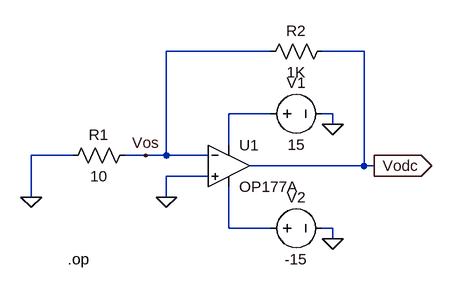
[diagram p0: schematic Run_1.asc]
Run_1.asc, the LTspice schematic file:
Version 4
SHEET 1 880 680
WIRE 352 -32 192 -32
WIRE 496 -32 432 -32
WIRE 352 64 288 64
WIRE 448 64 432 64
WIRE 448 80 448 64
WIRE 288 112 288 64
WIRE 48 128 -16 128
WIRE 160 128 128 128
WIRE 192 128 192 -32
WIRE 192 128 160 128
WIRE 256 128 192 128
WIRE 496 144 496 -32
WIRE 496 144 320 144
WIRE 512 144 496 144
WIRE 256 160 192 160
WIRE -16 192 -16 128
WIRE 192 192 192 160
WIRE 288 240 288 176
WIRE 352 240 288 240
WIRE 448 240 432 240
WIRE 448 256 448 240
FLAG 448 80 0
FLAG 448 256 0
FLAG 192 192 0
FLAG 512 144 Vodc
IOPIN 512 144 Out
FLAG -16 192 0
FLAG 160 128 Vos
SYMBOL OpAmps\\OP177A 288 80 R0
SYMATTR InstName U1
SYMBOL voltage 336 64 R270
WINDOW 0 32 56 VTop 2
WINDOW 3 -32 56 VBottom 2
WINDOW 123 0 0 Left 0
WINDOW 39 0 0 Left 0
SYMATTR InstName V1
SYMATTR Value 15
SYMBOL voltage 336 240 R270
WINDOW 0 32 56 VTop 2
WINDOW 3 -32 56 VBottom 2
WINDOW 123 0 0 Left 0
WINDOW 39 0 0 Left 0
SYMATTR InstName V2
SYMATTR Value -15
SYMBOL res 448 -48 R90
WINDOW 0 0 56 VBottom 2
WINDOW 3 32 56 VTop 2
SYMATTR InstName R2
SYMATTR Value 1K
SYMBOL res 144 112 R90
WINDOW 0 0 56 VBottom 2
WINDOW 3 32 56 VTop 2
SYMATTR InstName R1
SYMATTR Value 10
TEXT 40 288 Left 2 !.op

The netlist it stands for:
* Run_1.asc
XU1 0 Vos N001 N002 Vodc OP177A  ; pins In+ In- V+ V- OUT
V1 N001 0 15
V2 N002 0 -15
R2 Vodc Vos 1K
R1 Vos 0 10
.op
.backanno
.end